# EAGLE schematic PSLVCommutationRobot (EAGLE 6.3)
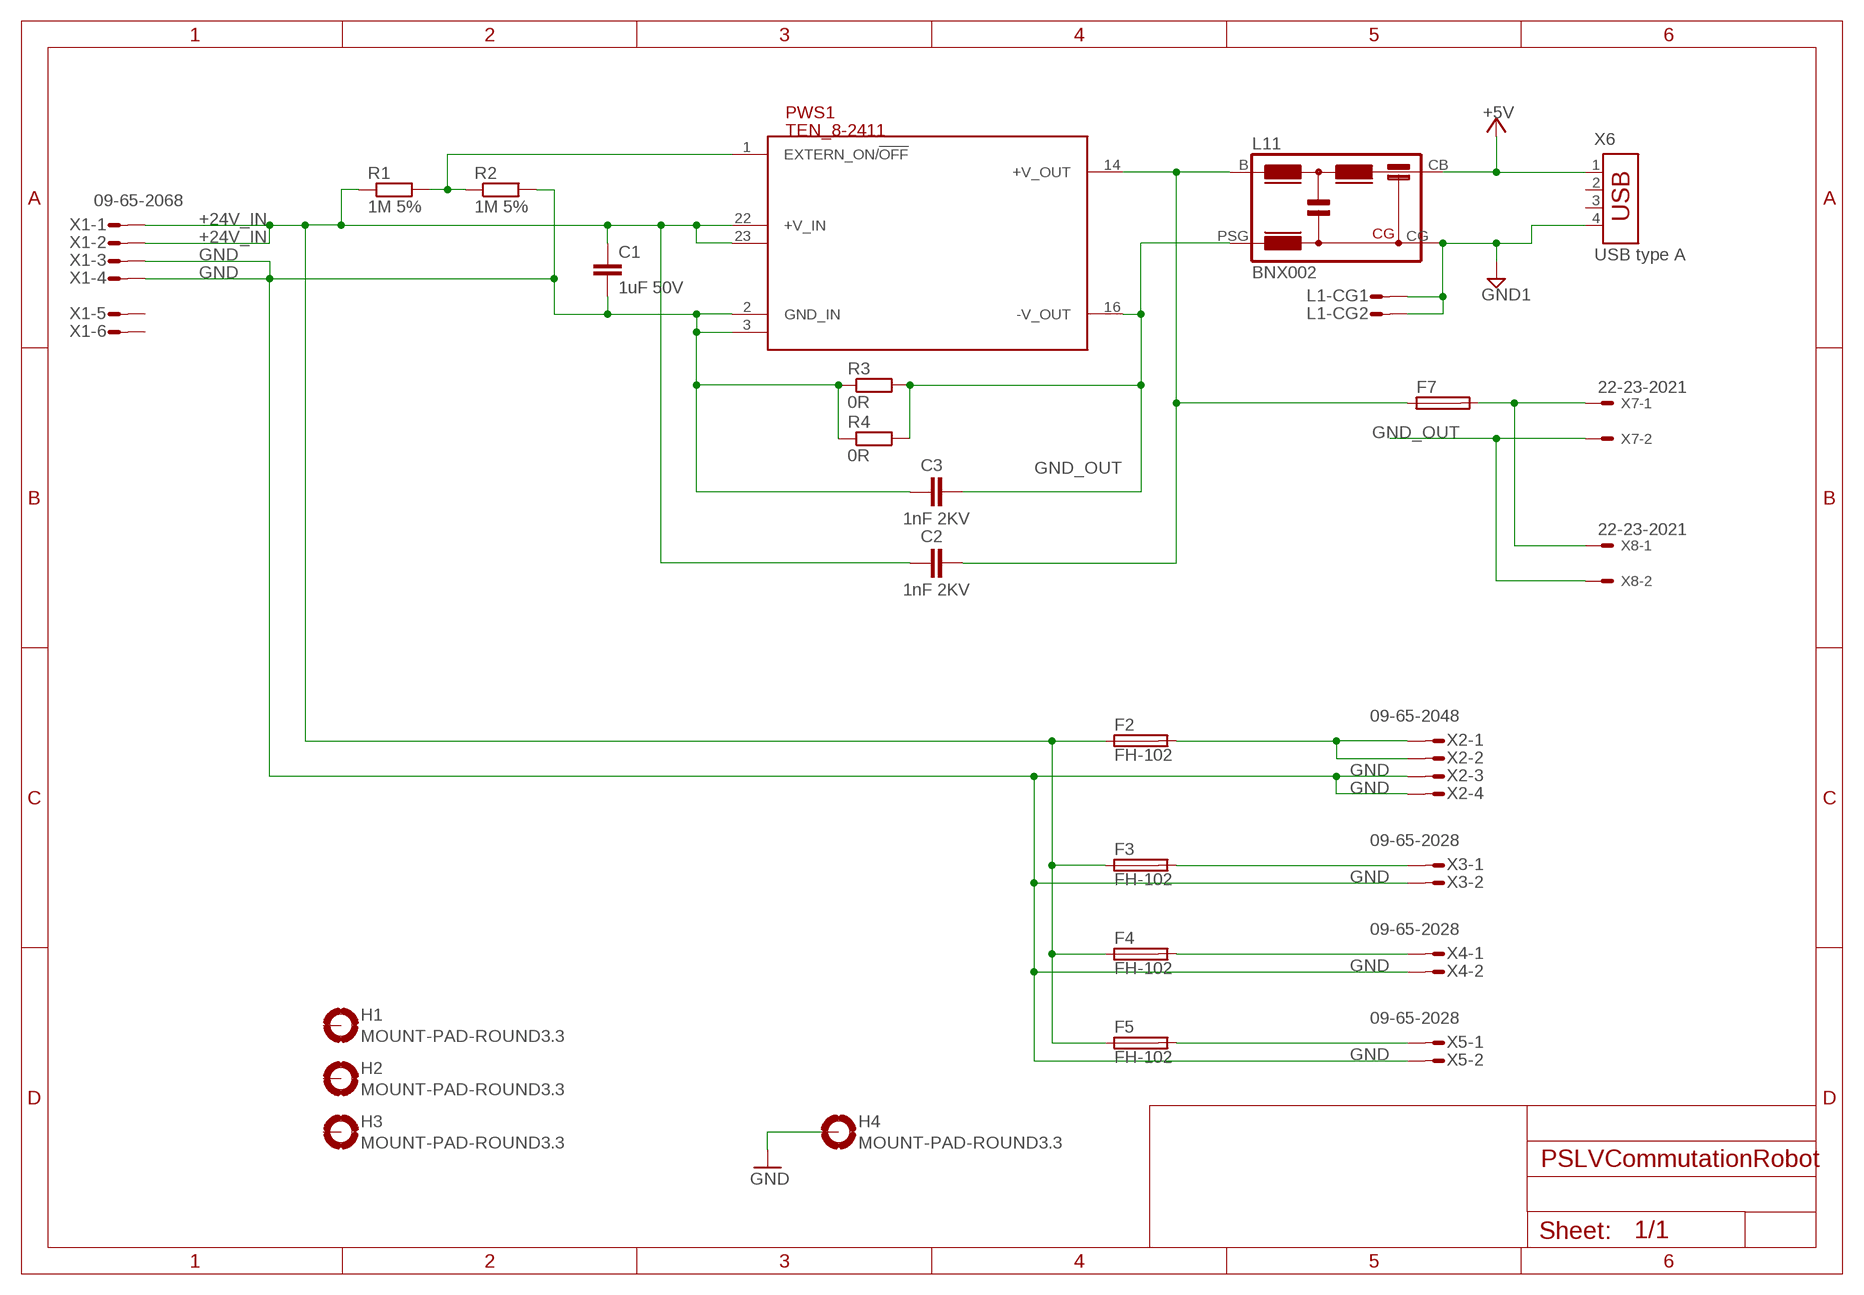
[diagram p0: schematic, sheet 1]

## Parts
C1  1uF 50V  C-EUC1210  [C1210]
C2  1nF 2KV  C-EUC1206  [C1206]
C3  1nF 2KV  C-EUC1206  [C1206]
F2  FH-102  SH22,5  [SH22,5]
F3  FH-102  SH22,5  [SH22,5]
F4  FH-102  SH22,5  [SH22,5]
F5  FH-102  SH22,5  [SH22,5]
F7  SH22,5  [SH22,5]
H1  MOUNT-PAD-ROUND3.3  [3,3-PAD]
H2  MOUNT-PAD-ROUND3.3  [3,3-PAD]
H3  MOUNT-PAD-ROUND3.3  [3,3-PAD]
H4  MOUNT-PAD-ROUND3.3  [3,3-PAD]
L1  BNX002  [BNX002]
PWS1  TEN_8-2411  TRACO_TEN_8-2411  [TRACO_TEN_8_SERIE]
R1  1M 5%  R-EU_R1206  [R1206]
R2  1M 5%  R-EU_R1206  [R1206]
R3  0R  R-EU_R1206  [R1206]
R4  0R  R-EU_R1206  [R1206]
X1  09-65-2068  MOLEX_09-65-2068  [MOLEX_09-65-2068]
X2  09-65-2048  MOLEX_09-65-2048  [MOLEX_09-65-2048]
X3  09-65-2028  MOLEX_09-65-2028  [MOLEX_09-65-2028]
X4  09-65-2028  MOLEX_09-65-2028  [MOLEX_09-65-2028]
X5  09-65-2028  MOLEX_09-65-2028  [MOLEX_09-65-2028]
X6  USB type A  USB-787616  [USB]
X7  22-23-2021  [22-23-2021]
X8  22-23-2021  [22-23-2021]

## Nets
+5V: L1.CB(1:CB) X6.1
+5V_OUT: C2.2 F7.1 L1.B(1:B) PWS1.14(+V_OUT)
+24V_IN: C1.1 C2.1 F2.1 F3.1 F4.1 F5.1 PWS1.22(+V_IN) PWS1.23(+V_IN2) R1.1 X1.1 X1.2
GND: C1.2 C3.1 H4.B3,3(MOUNT) PWS1.2(GND_IN) PWS1.3(GND_IN2) R2.2 R3.1 R4.1 X1.3 X1.4 X2.3 X2.4 X3.2 X4.2 X5.2
GND1: L1.CG1(-CG1:S) L1.CG2(-CG2:S) L1.CG(1:CG) X6.4
GND_OUT: C3.2 L1.PSG(1:PSG) PWS1.16(-V_OUT) R3.2 R4.2 X7.2 X8.2
N$1: PWS1.1(EXTERN_ON/!OFF) R1.2 R2.1
N$2: F2.2 X2.1 X2.2
N$3: F3.2 X3.1
N$4: F7.2 X7.1 X8.1
N$5: F5.2 X5.1
N$6: F4.2 X4.1
Unconnected: H1.B3,3(MOUNT) H2.B3,3(MOUNT) H3.B3,3(MOUNT) X1.5 X1.6 X6.2 X6.3

## Library data of the parts
C1-C3 = rcl:C-EU: CAPACITOR, European symbol
F2-F5 F7 = fuse:SH22,5: FUSE HOLDER grid 22,5 mm, OGN0031 8201, Schurter (Buerklin); MF: SCHURTER; MPN: 0031.8201; OC_FARNELL: 1162740; OC_NEWARK: 96F8317
H1-H4 = holes:MOUNT-PAD-ROUND: MOUNTING PAD, round
L1 = my_components:BNX002: FILTER
PWS1 = my_components:TRACO_TEN_8-2411
R1-R4 = rcl:R-EU_: RESISTOR, European symbol
X1 = my_components:MOLEX_09-65-2068
X2 = my_components:MOLEX_09-65-2048: STECKER, 3.96MM KK, 4KONTAKTE
X3-X5 = my_components:MOLEX_09-65-2028
X6 = con-amp:USB-787616: AMP connector
X7 X8 = con-molex:22-23-2021: .100" (2.54mm) Center Header - 2 Pin; MF: MOLEX; MPN: 22-23-2021; OC_FARNELL: 1462926; OC_NEWARK: 25C3832